# EAGLE design traffic_control (EAGLE 5.11)
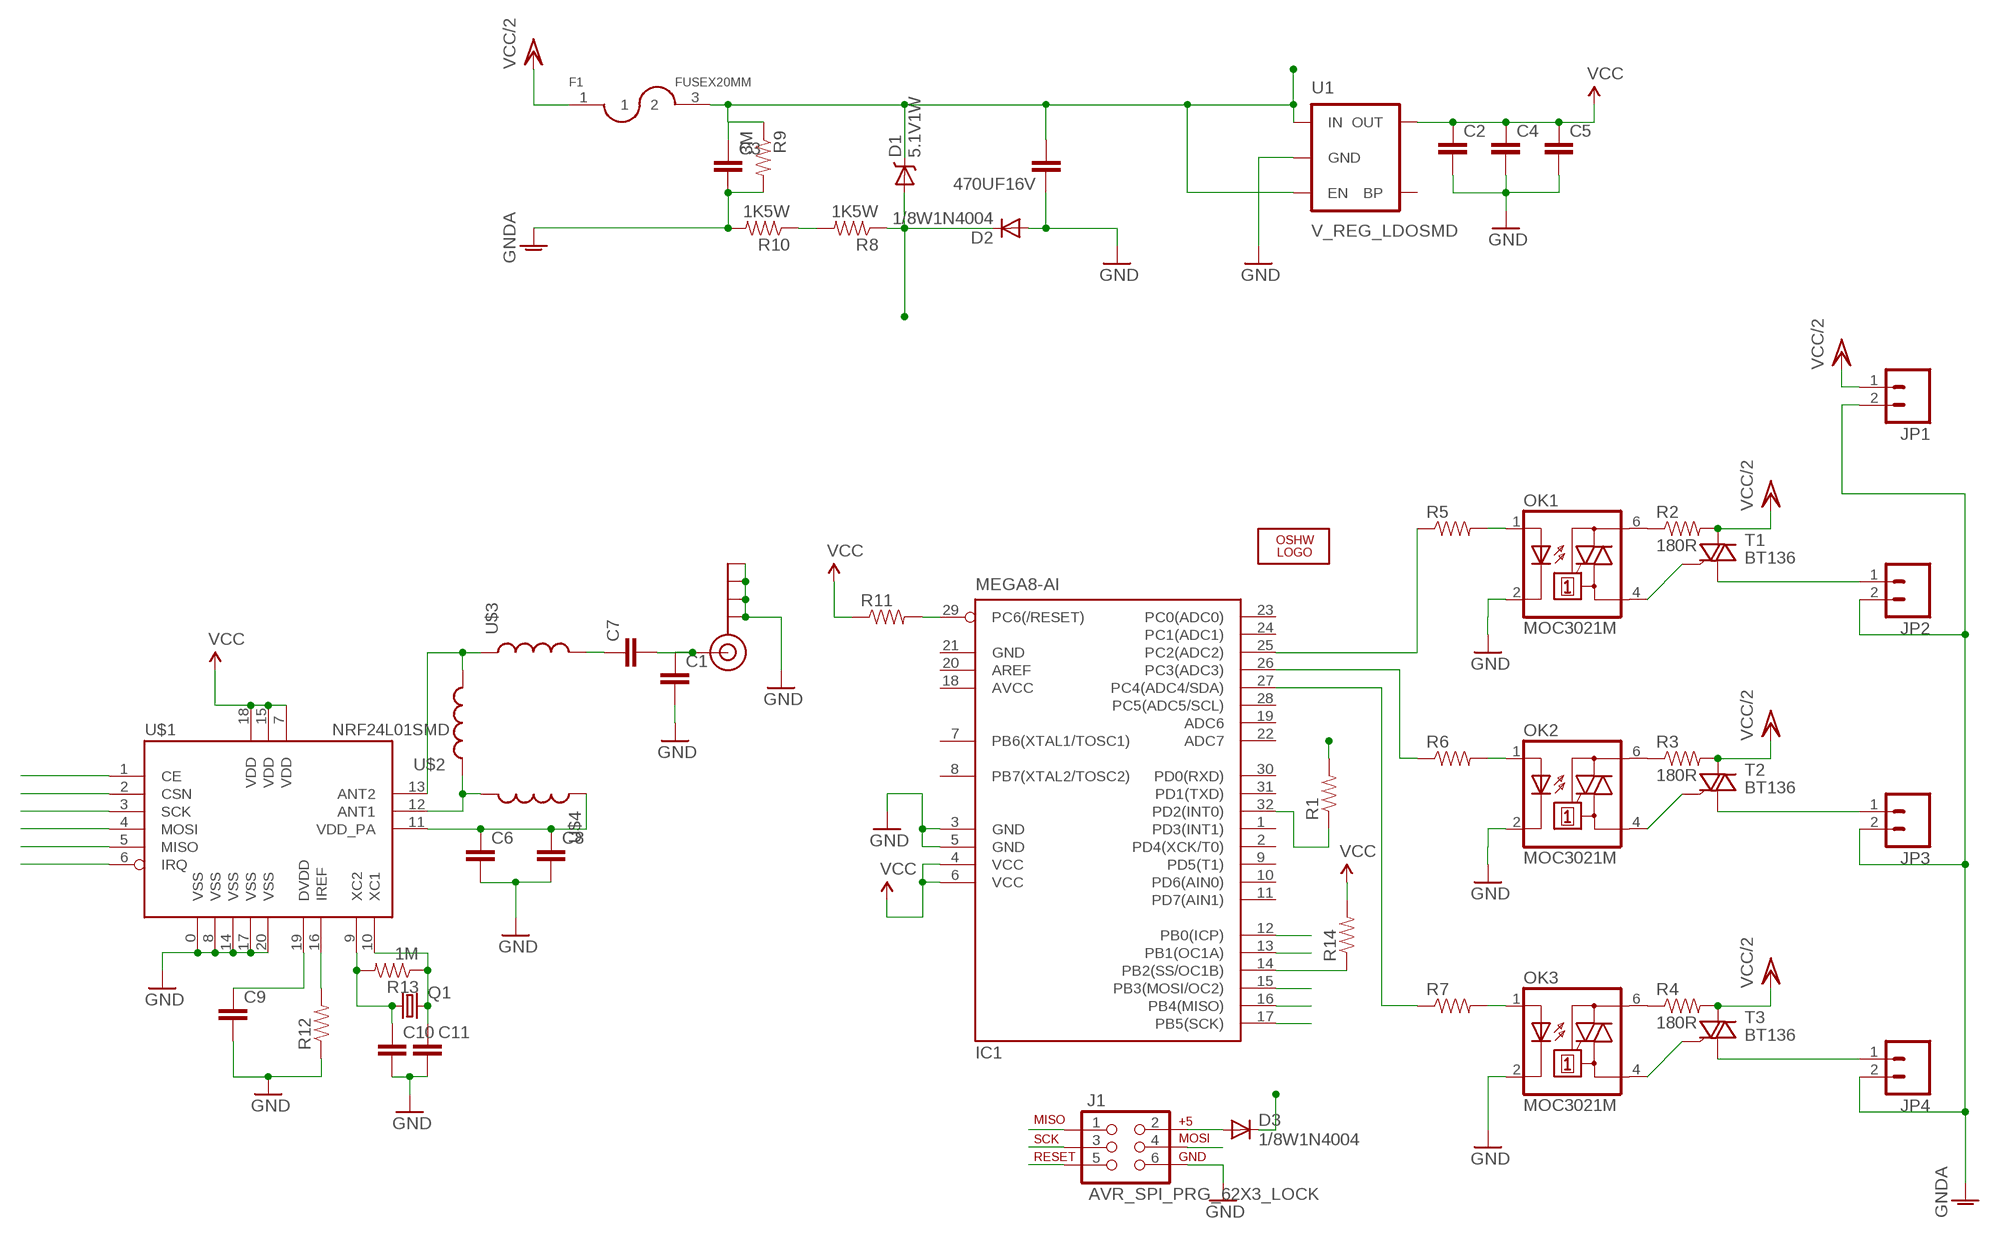
[diagram p0: schematic, sheet 1]

## Parts
470UF16V  CAP_  [AXIAL-5MM]
C1  CAP0805  [0805]
C2  CAP1206  [1206]
C3  CAP1206  [1206]
C4  CAP1206  [1206]
C5  CAP1206  [1206]
C6  CAP1206  [1206]
C7  CAP1206  [1206]
C8  CAP1206  [1206]
C9  CAP1206  [1206]
C10  CAP1206  [1206]
C11  CAP1206  [1206]
D1  5.1V1W  DIODE-SCHOTTKY_  [SMA-DIODE]
D2  1/8W1N4004  1N4004  [DO41-10]
D3  1/8W1N4004  1N4004  [DO41-10]
F1  FUSEX20MM  [FUSE_5MM]
IC1  MEGA8-AI  [TQFP32-08]
J1  AVR_SPI_PRG_62X3_LOCK  [2X3_LOCK]
J$1  SMA_EDGE  [SMA-EDGE]
JP1  M02LOCK  [1X02_LOCK]
JP2  M02LOCK  [1X02_LOCK]
JP3  M02LOCK  [1X02_LOCK]
JP4  M02LOCK  [1X02_LOCK]
LOGO1  OSHW_LOGO_10MILX0350-NT  [OSHW_10X350_NOTEXT]
OK1  MOC3021M  [DIL06]
OK2  MOC3021M  [DIL06]
OK3  MOC3021M  [DIL06]
Q1  CRYSTAL5X3  [CRYSTAL-SMD-5X3]
R1  RESISTOR1206  [1206]
R2  180R  RESISTOR1206  [1206]
R3  180R  RESISTOR1206  [1206]
R4  180R  RESISTOR1206  [1206]
R5  RESISTOR1206  [1206]
R6  RESISTOR1206  [1206]
R7  RESISTOR1206  [1206]
R8  1K5W  RESISTOR1206  [1206]
R9  3M  RESISTOR1206  [1206]
R10  1K5W  RESISTOR1206  [1206]
R11  RESISTOR1206  [1206]
R12  RESISTOR1206  [1206]
R13  1M  RESISTOR1206  [1206]
R14  RESISTOR1206  [1206]
T1  BT136  [TO220AB]
T2  BT136  [TO220AB]
T3  BT136  [TO220AB]
U1  V_REG_LDOSMD  [SOT23-5]
U$1  NRF24L01SMD  [QFN20]
U$2  INDUCTOR0603  [0603]
U$3  INDUCTOR0603  [0603]
U$4  INDUCTOR0603  [0603]

## Nets
CE: IC1.13(PB1(OC1A)) U$1.1(CE)
CROSSING_OUT: D1.A D2.C R1.2 R8.1
CS: IC1.14(PB2(SS/OC1B)) R14.1 U$1.2(CSN)
GND: 470UF16V.P$1 C1.2 C2.2 C4.2 C5.2 C6.2 C8.2 C9.2 C10.2 C11.2 D2.A IC1.3(GND) IC1.5(GND) J1.6 J$1.GND@0(GND) J$1.GND@1(GND) J$1.GND@2(GND) J$1.GND@3(GND) OK3.2(C) R12.1 U1.2(GND) U$1.0(VSS) U$1.8(VSS) U$1.14(VSS) U$1.17(VSS) U$1.20(VSS)
GNDA: C3.2 JP1.2 JP2.2 JP3.2 JP4.2 R9.2 R10.2
IRQ: IC1.12(PB0(ICP)) U$1.6(IRQ)
MISO: IC1.16(PB4(MISO)) J1.1 U$1.5(MISO)
MOSI: IC1.15(PB3(MOSI/OC2)) J1.4 U$1.4(MOSI)
N$1: OK1.1(A) R5.2
N$2: OK2.1(A) R6.2
N$3: OK1.4(A1) T1.3(G)
N$4: OK2.4(A1) T2.3(G)
N$5: JP2.1 T1.1(A1)
N$6: JP3.1 T2.1(A1)
N$7: JP4.1 T3.1(A1)
N$8: OK3.4(A1) T3.3(G)
N$9: OK1.6(A2) R2.1
N$10: OK2.6(A2) R3.1
N$11: OK3.6(A2) R4.1
N$12: OK1.2(C)
N$13: OK2.2(C)
N$14: OK3.1(A) R7.2
N$15: IC1.32(PD2(INT0)) R1.1
N$16: R8.2 R10.1
N$17: IC1.25(PC2(ADC2)) R5.1
N$18: IC1.26(PC3(ADC3)) R6.1
N$19: IC1.27(PC4(ADC4/SDA)) R7.1
N$20: U$1.13(ANT2) U$2.2 U$3.1
N$21: U$1.12(ANT1) U$2.1 U$4.2
N$22: D3.A J1.2
N$23: C7.1 U$3.2
N$24: C6.1 C8.1 U$1.11(VDD_PA) U$4.1
N$25: C1.1 C7.2 J$1.SIG(SIGNAL)
N$26: C9.1 U$1.19(DVDD)
N$27: R12.2 U$1.16(IREF)
N$28: C10.1 Q1.1 R13.2 U$1.9(XC2)
N$31: C11.1 Q1.3 R13.1 U$1.10(XC1)
RESET: IC1.29(PC6(/RESET)) J1.5 R11.2
SCK: IC1.17(PB5(SCK)) J1.3 U$1.3(SCK)
VCC: C2.1 C4.1 C5.1 IC1.4(VCC) IC1.6(VCC) R11.1 R14.2 U1.5(OUT) U$1.7(VDD) U$1.15(VDD) U$1.18(VDD)
VCC/2: F1.1 JP1.1 R2.2 R3.2 R4.2 T1.2(A2) T2.2(A2) T3.2(A2)
VIN: 470UF16V.P$2 C3.1 D1.C D3.C F1.3 R9.1 U1.1(IN) U1.3(EN)
Unconnected: IC1.1(PD3(INT1)) IC1.2(PD4(XCK/T0)) IC1.7(PB6(XTAL1/TOSC1)) IC1.8(PB7(XTAL2/TOSC2)) IC1.9(PD5(T1)) IC1.10(PD6(AIN0)) IC1.11(PD7(AIN1)) IC1.19(ADC6) IC1.20(AREF) IC1.22(ADC7) IC1.23(PC0(ADC0)) IC1.24(PC1(ADC1)) IC1.28(PC5(ADC5/SCL)) IC1.30(PD0(RXD)) IC1.31(PD1(TXD)) U1.4(BP)

## Power pins joined to a net without a drawn wire
AVCC: IC1.18(AVCC)
GND: IC1.21(GND)

## Library data of the parts
470UF16V C1-C11 = SparkFun:CAP: Capacitor Standard 0603 ceramic capacitor, and 0.1" leaded capacitor.
D1 = SparkFun:DIODE-SCHOTTKY
D2 D3 = diode:1N4004: DIODE general purpose rectifier, 1 A
F1 = SparkFun:FUSE
IC1 = atmel:MEGA8: MICROCONTROLLER 8 Kbytes FLASH, 1 kbytes SRAM, 512 bytes EEPROM, USART, 6-channel 10 bit ADC, 2-channel 8 bit ADC Pin compatible with Atmega48, ATMega88, ATMega168 Source: avr.lbr; MPN: ATMEGA8-16AU; OC_FARNELL: 9171371; OC_NEWARK: 73M8863
J1 = SparkFun:AVR_SPI_PRG_6: AVR ISP 6 Pin This is the reduced ISP connector for AVR programming. Common on Arduino. This footprint will take up less PCB space and can be used with a 10-pin to 6-pin adapter such as SKU: BOB-08508
J$1 = SparkFun:SMA_EDGE: SMA Antenna Connector End launch SMA connector. The paste layer has been removed so that the connector can be hand soldered onto the board after reflow.
JP1-JP4 = SparkFun:M02: Header 2 Standard 2-pin 0.1" header. Use with straight break away headers (SKU : PRT-00116), right angle break away headers (PRT-00553), swiss pins (PRT-00743), machine pins (PRT-00117), and female headers (PRT-00115). Molex polarized connector foot print use with SKU : PRT-08233 with associated crimp pins and housings.
LOGO1 = OSHW:OSHW_LOGO_10MIL
OK1-OK3 = optocoupler:MOC30*M: RANDOM-PHASE OPTOISOLATORS TRIAC DRIVER OUTPUT Source: http://www.fairchildsemi.com MOC3020-M.pdf; MF: FAIRCHILD SEMICONDUCTOR; MPN: MOC3021-M; OC_FARNELL: 1021365; OC_NEWARK: 95B7895
Q1 = SparkFun:CRYSTAL: Crystals Various standard crystals. Proven footprints. Spark Fun Electronics SKU : COM-00534
R1-R14 = SparkFun:RESISTOR: Resistor Basic schematic elements and footprints for 0603, 1206, and PTH 1/10th watt (small) resistors.
T1-T3 = triac:BT136: Triac BT136 series E sensitive gate Source: http://www.nxp.com/acrobat_download/datasheets/BT136_SERIES_E_2.pdf
U1 = SparkFun:V_REG_LDO: Voltage Regulator LDO Standard 150mA LDO voltage regulator in SOT-23 layout. Micrel part MIC5205. BP (by-pass) pin is used to lower output noise with 470pF cap.
U$1 = SparkFun:NRF24L01: 2.4GHz Low Power Transceiver This is the very popular, low cost, very low power RF transceiver from Nordic Semiconductor. Simple SPI interface. SKU: COM-00690
U$2-U$4 = SparkFun:INDUCTOR: Inductors Basic Inductor/Choke - 0603 and 1206. Footprints are not proven and vary greatly between part numbers.

## Board
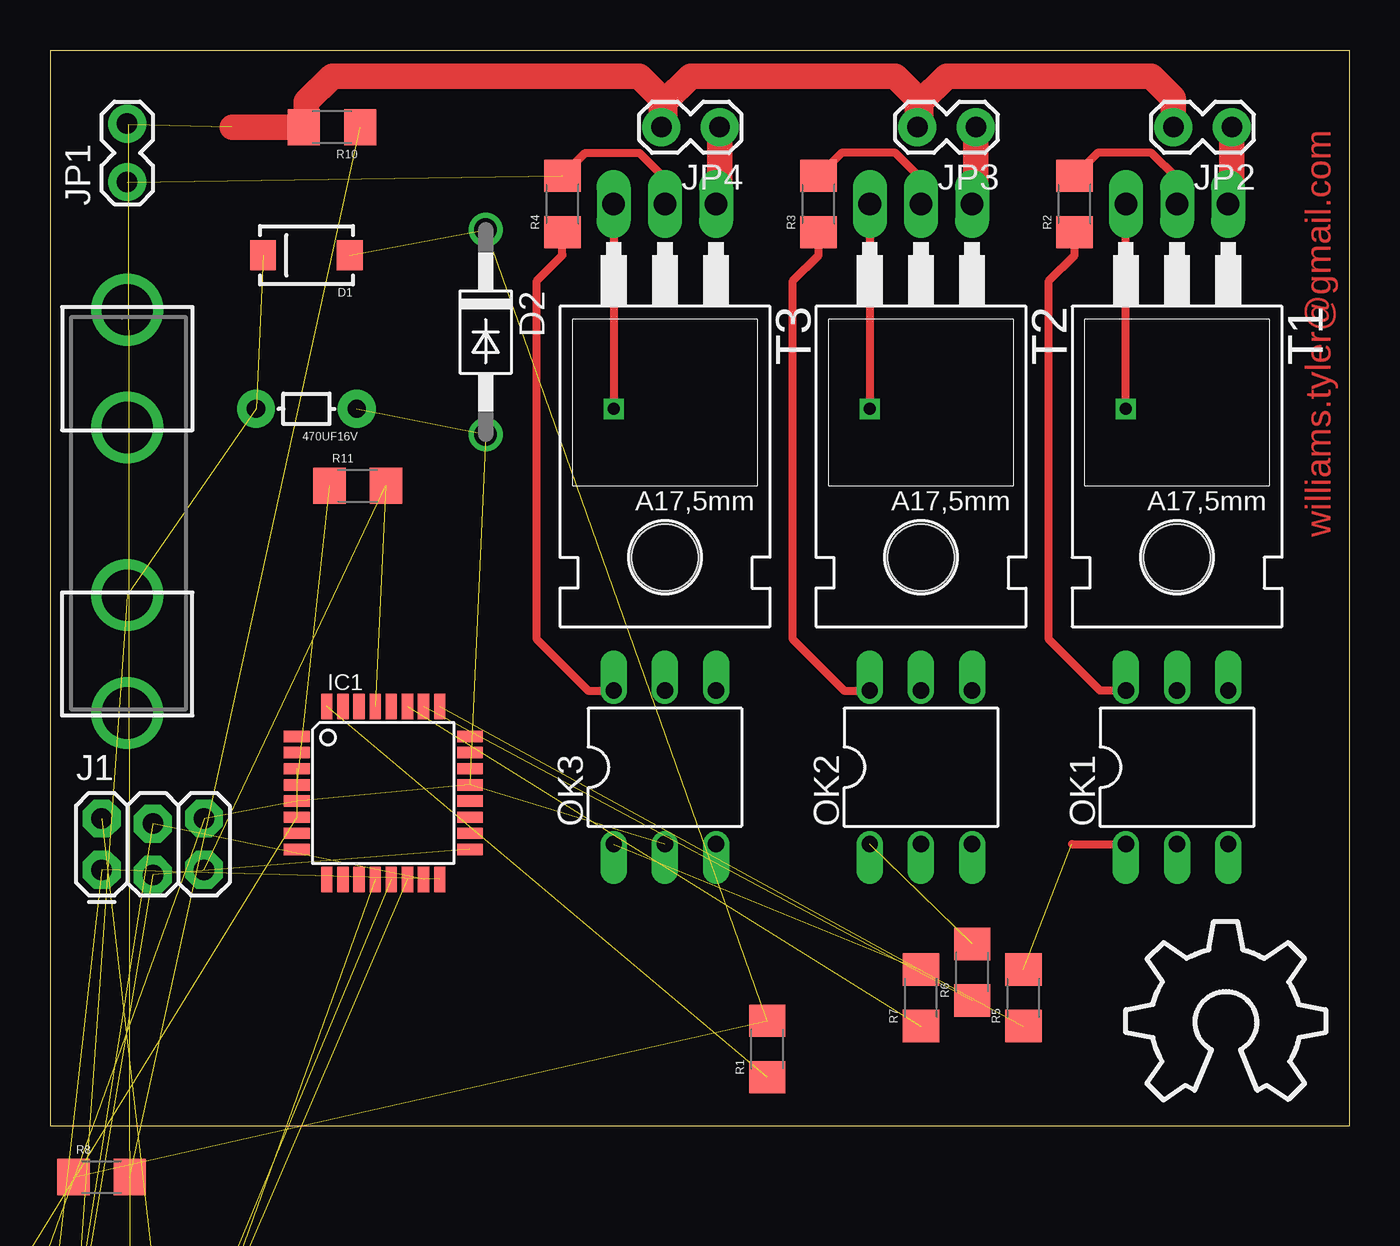
[diagram p1: board, top side]
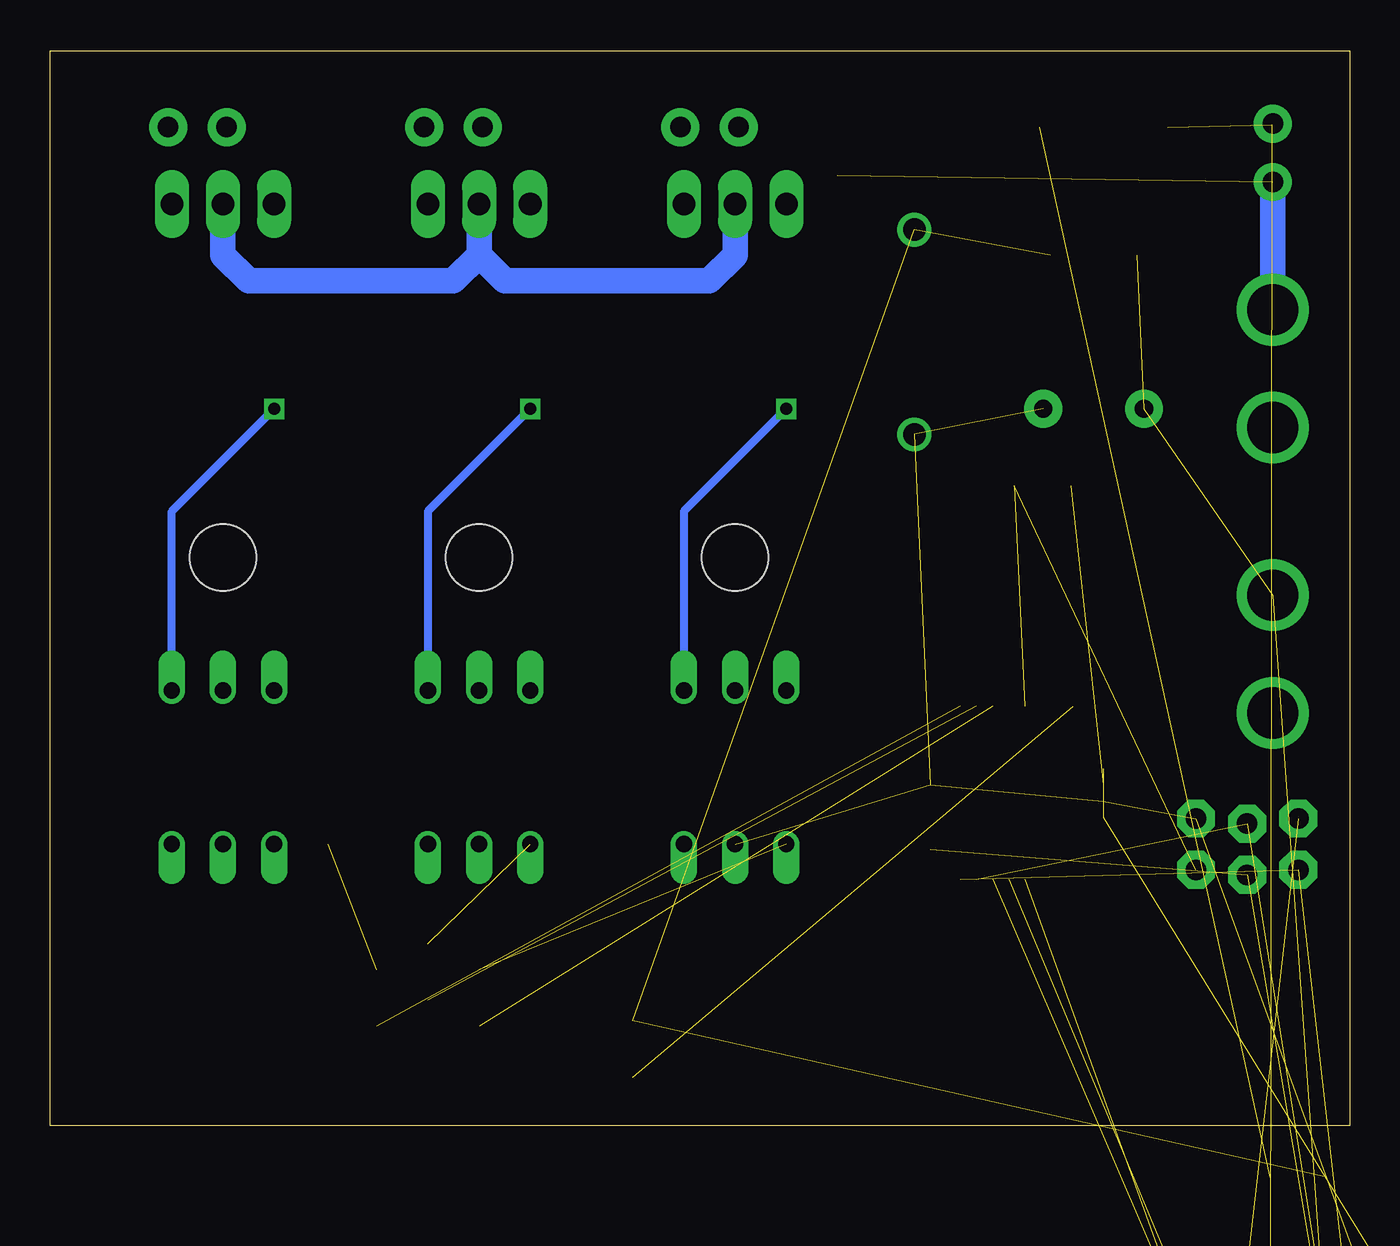
[diagram p2: board, bottom side, seen from below]

Size 64.44 x 53.33 mm. Coordinates in mm from the lower left corner, seen from the top.
Outline: 0,0 64.44,0 64.44,53.33 0,53.33 0,0
Copper layers (1*16): Top 0.035mm / dielectric 1.5mm / Bottom 0.035mm
Design rules "default": minimum track width 10mil, minimum drill 24mil, track to track 8mil, track to pad 8mil, pad to pad 8mil, via to via 8mil, smd to smd 8mil, copper to edge 40mil, drill to drill 8mil, minimum pad ring 10mil, minimum via ring 8mil, stop-mask expansion 4mil, vias tented up to drill 0mil, thermal gap 10mil

### Footprints (pad centres in the part's own frame; a part is rotated, then mirrored left to right if it is on the bottom)
AXIAL-5MM = drill 0.9 pad 1.88 round: P$1 -2.5,0; P$2 2.5,0
0805 = smd 0.8 x 1.2: 1 -0.9,0; 2 0.9,0
1206 = smd 1.6 x 1.8: 1 -1.4,0; 2 1.4,0
SMA-DIODE = smd 1.27 x 1.47: A -2.15,0; C 2.15,0
DO41-10 = drill 1.118 round: A 5.08,0; C -5.08,0
FUSE_5MM = drill 2.54 pad 3.556 round: 1 0,-10; 2 0,-4.158; 3 0,4.158; 4 0,10
TQFP32-08 = smd 1.27 x 0.559: 1 -4.293,2.8; 2 -4.293,2; 3 -4.293,1.2; 4 -4.293,0.4; 5 -4.293,-0.4; 6 -4.293,-1.2; 7 -4.293,-2; 8 -4.293,-2.8; 17 4.293,-2.8; 18 4.293,-2; 19 4.293,-1.2; 20 4.293,-0.4; 21 4.293,0.4; 22 4.293,1.2; 23 4.293,2; 24 4.293,2.8 | smd 0.559 x 1.27: 9 -2.8,-4.293; 10 -2,-4.293; 11 -1.2,-4.293; 12 -0.4,-4.293; 13 0.4,-4.293; 14 1.2,-4.293; 15 2,-4.293; 16 2.8,-4.293; 25 2.8,4.293; 26 2,4.293; 27 1.2,4.293; 28 0.4,4.293; 29 -0.4,4.293; 30 -1.2,4.293; 31 -2,4.293; 32 -2.8,4.293
2X3_LOCK = drill 1.016 pad 1.88 octagon: 1 0,0; 2 0,2.54; 3 2.54,-0.254; 4 2.54,2.286; 5 5.08,0; 6 5.08,2.54
SMA-EDGE = smd 1.524 x 4.064: GND@0 0,0; GND@1 5.08,0; SIG 2.54,0 | smd 1.524 x 4.064 bottom: GND@2 0,0; GND@3 5.08,0
1X02_LOCK = drill 1.016 pad 1.88 round: 1 -0.178,0; 2 2.718,0
DIL06 = drill 0.813 offset: 1 -2.54,-3.81; 2 0,-3.81; 3 2.54,-3.81; 4 2.54,3.81; 5 0,3.81; 6 -2.54,3.81
CRYSTAL-SMD-5X3 = smd 1.9 x 1.1: 1 -1.85,-1.15; 2 1.85,-1.15; 3 1.85,1.15; 4 -1.85,1.15
TO220AB = drill 1.118 long: 1 -2.54,-6.35; 2 0,-6.35; 3 2.54,-6.35 | hole 3.302: 0,11.176
SOT23-5 = smd 0.55 x 1.2: 1 -0.95,-1.3; 2 0,-1.3; 3 0.95,-1.3; 4 0.95,1.3; 5 -0.95,1.3
QFN20 = smd 1 x 1: 0 0,0 | smd 0.65 x 0.3: 1 -1.9,1; 2 -1.9,0.5; 3 -1.9,0; 4 -1.9,-0.5; 5 -1.9,-1; 11 1.9,-1; 12 1.9,-0.5; 13 1.9,0; 14 1.9,0.5; 15 1.9,1 | smd 0.3 x 0.65: 6 -1,-1.9; 7 -0.5,-1.9; 8 0,-1.9; 9 0.5,-1.9; 10 1,-1.9; 16 1,1.9; 17 0.5,1.9; 18 0,1.9; 19 -0.5,1.9; 20 -1,1.9
0603 = smd 1.1 x 1: 1 -0.85,0; 2 0.85,0

### Placement (x,y rotation side)
470UF16V  12.7,35.56 180 top
C1  -6.35,-73.66 0 top  (outside the outline)
C2  -1.27,-55.88 0 top  (outside the outline)
C3  -1.27,-67.31 0 top  (outside the outline)
C4  -1.27,-59.69 0 top  (outside the outline)
C5  -1.27,-63.5 0 top  (outside the outline)
C6  -5.08,-78.74 0 top  (outside the outline)
C7  -1.27,-74.93 0 top  (outside the outline)
C8  -5.08,-82.55 0 top  (outside the outline)
C9  -5.08,-91.44 0 top  (outside the outline)
C10  -5.08,-105.41 0 top  (outside the outline)
C11  -5.08,-109.22 0 top  (outside the outline)
D1  12.7,43.18 180 top
D2  21.59,39.37 270 top
D3  2.54,-29.21 0 top  (outside the outline)
F1  3.81,30.48 180 top
IC1  16.51,16.51 0 top
J1  2.54,12.7 0 top
J$1  -6.35,-86.36 0 top  (outside the outline)
JP1  3.81,46.99 90 top
JP2  58.42,49.53 180 top
JP3  45.72,49.53 180 top
JP4  33.02,49.53 180 top
LOGO1  53.34,1.27 0 top
OK1  55.88,17.78 0 top
OK2  43.18,17.78 0 top
OK3  30.48,17.78 0 top
Q1  -5.08,-100.33 0 top  (outside the outline)
R1  35.56,3.81 90 top
R2  50.8,45.72 90 top
R3  38.1,45.72 90 top
R4  25.4,45.72 90 top
R5  48.26,6.35 90 top
R6  45.72,7.62 90 top
R7  43.18,6.35 90 top
R8  2.54,-2.54 0 top
R9  2.54,-11.43 0 top  (outside the outline)
R10  13.97,49.53 180 top
R11  15.24,31.75 0 top
R12  -5.08,-95.25 0 top  (outside the outline)
R13  -5.08,-113.03 0 top  (outside the outline)
R14  -5.08,-118.11 0 top  (outside the outline)
T1  55.88,39.37 180 top
T2  43.18,39.37 180 top
T3  30.48,39.37 180 top
U1  -2.54,-11.43 0 top  (outside the outline)
U$1  -1.27,-36.83 0 top  (outside the outline)
U$2  -2.54,-40.64 0 top  (outside the outline)
U$3  -2.54,-44.45 0 top  (outside the outline)
U$4  -2.54,-48.26 0 top  (outside the outline)

### Tracks (layer width: path | path; a pad name or v marks a point on that pad's centre or on a via)
CE  (1 unrouted)
CROSSING_OUT  (3 unrouted)
CS  (2 unrouted)
GND  (26 unrouted)
GNDA  (3 unrouted)
  Top 1.27: JP2.2 55.7,50.98 54.61,52.07 44.45,52.07 43.18,50.8 43.18,49.71 JP3.2 43,50.98 41.91,52.07 31.75,52.07 30.48,50.8 30.48,49.71 JP4.2 30.3,50.98 29.21,52.07 13.97,52.07 12.7,50.8 12.7,49.66 R10.2 9.02,49.53 | JP1.2 3.86,49.66
IRQ  (1 unrouted)
MISO  (2 unrouted)
MOSI  (2 unrouted)
N$1  (1 unrouted)
  Top 0.406: 50.67,13.97 OK1.1
N$2  (1 unrouted)
N$3  (via drill 0.6)
  Top 0.406: v53.34,35.56 T1.3
  Bottom 0.406: OK1.4 58.42,30.48 v53.34,35.56
N$4  (via drill 0.6)
  Top 0.406: T2.3 v40.64,35.56
  Bottom 0.406: v40.64,35.56 45.72,30.48 OK2.4
N$5
  Top 1.27: JP2.1 58.6,45.9 T1.1
N$6
  Top 1.27: JP3.1 45.9,45.72 T2.1
N$7
  Top 1.27: JP4.1 33.2,45.72 T3.1
N$8  (via drill 0.6)
  Top 0.406: T3.3 v27.94,35.56
  Bottom 0.406: v27.94,35.56 33.02,30.48 OK3.4
N$9
  Top 0.406: R2.1 50.8,43.18 49.53,41.91 49.53,24.13 52.07,21.59 OK1.6
N$10
  Top 0.406: R3.1 38.1,43.18 36.83,41.91 36.83,24.13 39.37,21.59 OK2.6
N$11
  Top 0.406: R4.1 25.4,43.18 24.13,41.91 24.13,24.13 26.67,21.59 OK3.6
N$14  (1 unrouted)
N$15  (1 unrouted)
N$16  (1 unrouted)
N$17  (1 unrouted)
N$18  (1 unrouted)
N$19  (1 unrouted)
N$20  (2 unrouted)
N$21  (2 unrouted)
N$22  (1 unrouted)
N$23  (1 unrouted)
N$24  (3 unrouted)
N$25  (2 unrouted)
N$26  (1 unrouted)
N$27  (1 unrouted)
N$28  (3 unrouted)
N$31  (3 unrouted)
RESET  (2 unrouted)
SCK  (2 unrouted)
VCC  (10 unrouted)
VCC/2  (1 unrouted)
  Top 0.406: T1.2 55.88,46.99 54.61,48.26 51.94,48.26 R2.2 | T2.2 43.18,46.99 41.91,48.26 39.24,48.26 R3.2 | T3.2 30.48,46.99 29.21,48.26 26.54,48.26 R4.2
  Bottom 1.27: F1.1 JP1.1 | T3.2 30.48,43.18 31.75,41.91 41.91,41.91 43.18,43.18 | 43.18,43.18 T2.2 | T1.2 55.88,43.18 54.61,41.91 44.45,41.91 43.18,43.18
VIN  (7 unrouted)

### Text on the board
Top: williams.tyler@gmail.com